# Altium schematic sheet DC-DC_PWM_IV_Controller.SchDoc
size A0; SheetNumber: 1; SheetTotal: 1; SPICEModelCacheFPQAHQWD: <root> / <DocumentId>FPQAHQWD</DocumentId> / <CacheFrame Number="0"> / <Model Name="7850_74477530_1m" Kind="CKT"> / <Text>******* / .subckt 7850_74477530_1m 1 2 / Rp 1 2 187304.915771 / Cp 1 2 4.36976277949p / Rs 1 N3 3.3 / L1 N3 2 1000u / .ends 7850_74477530_1m</Text> / </Model> / </CacheFrame> / </root>
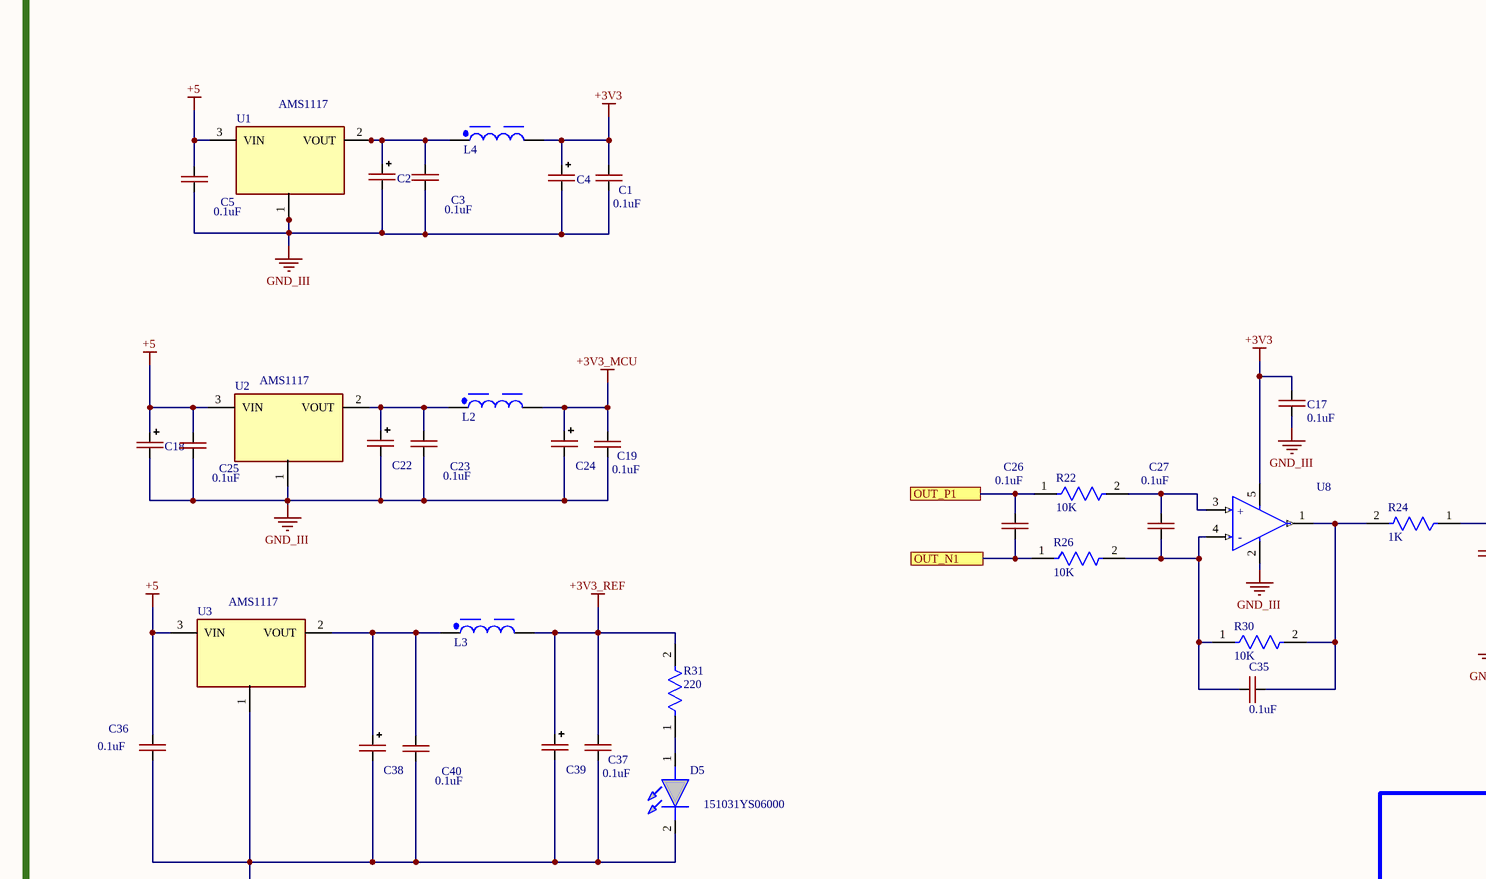
[diagram p0: DC-DC_PWM_IV_Controller.SchDoc, top left]
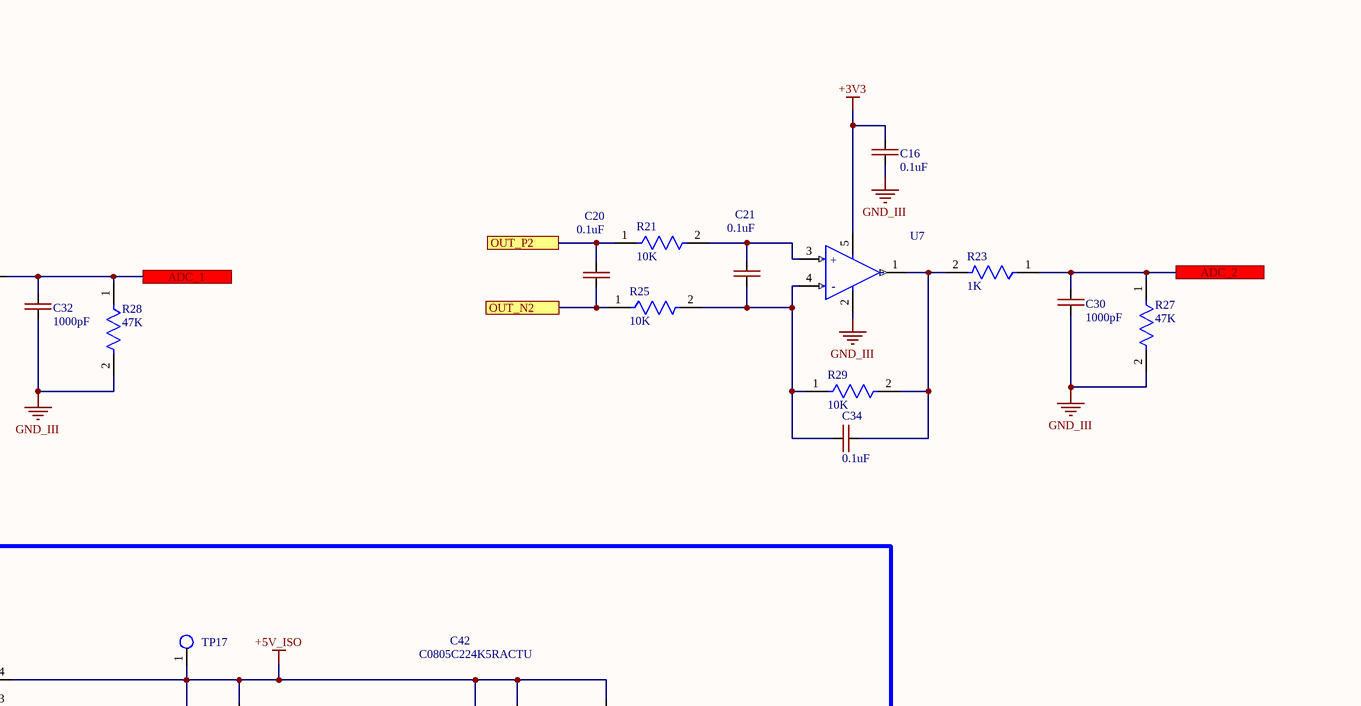
[diagram p1: DC-DC_PWM_IV_Controller.SchDoc, top middle]
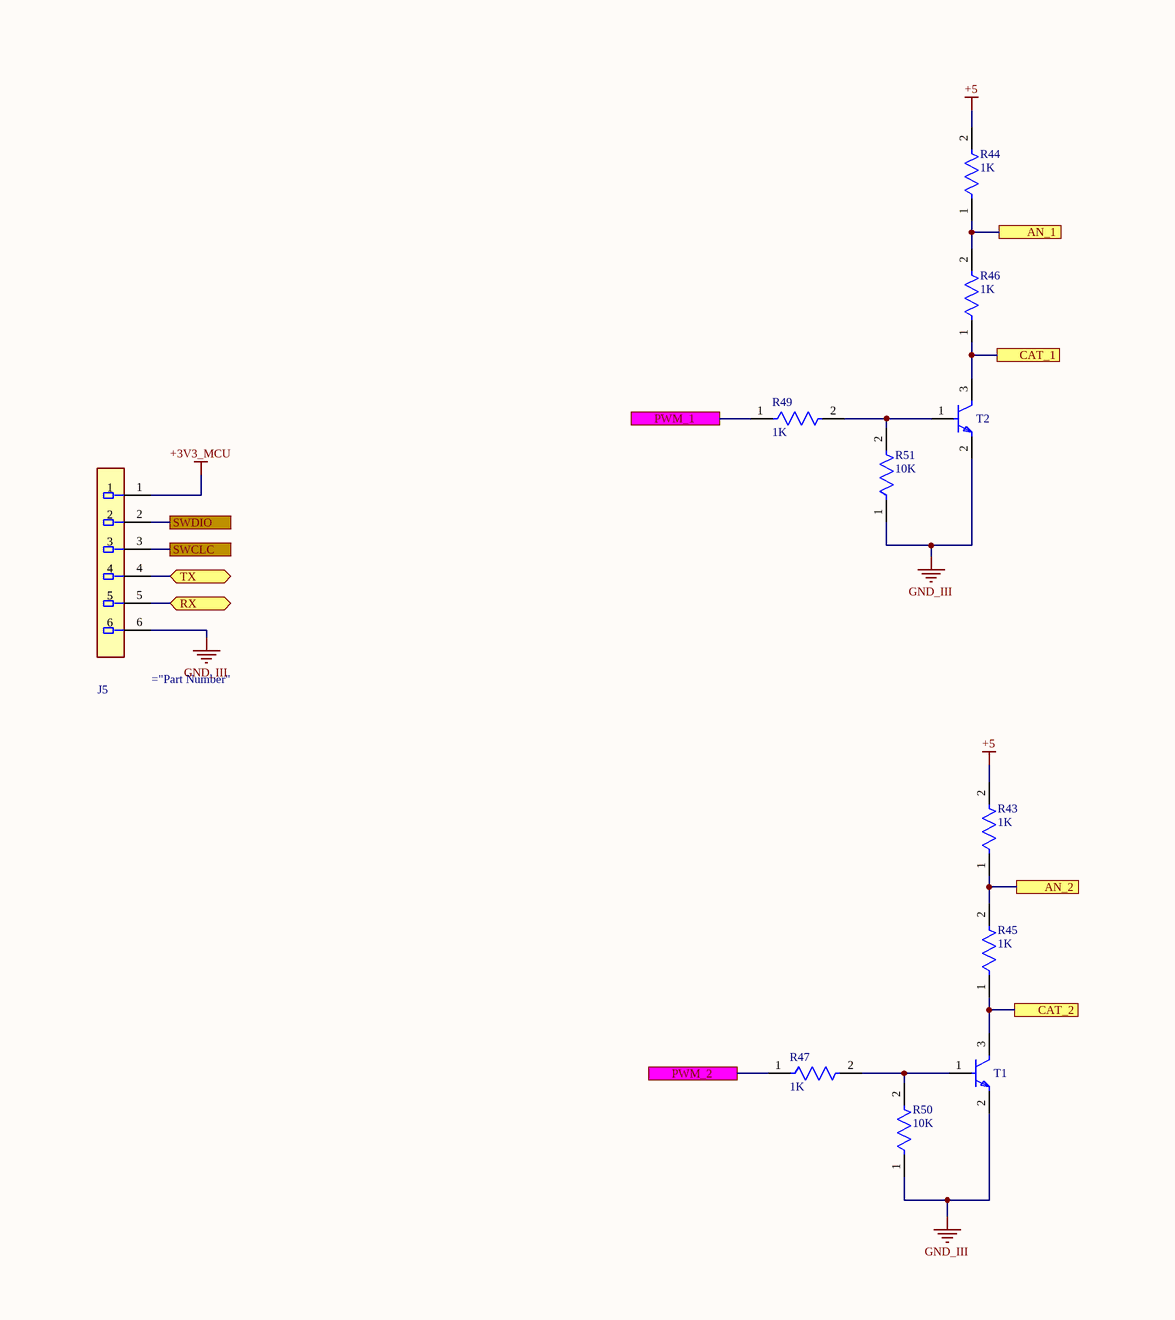
[diagram p2: DC-DC_PWM_IV_Controller.SchDoc, top right]
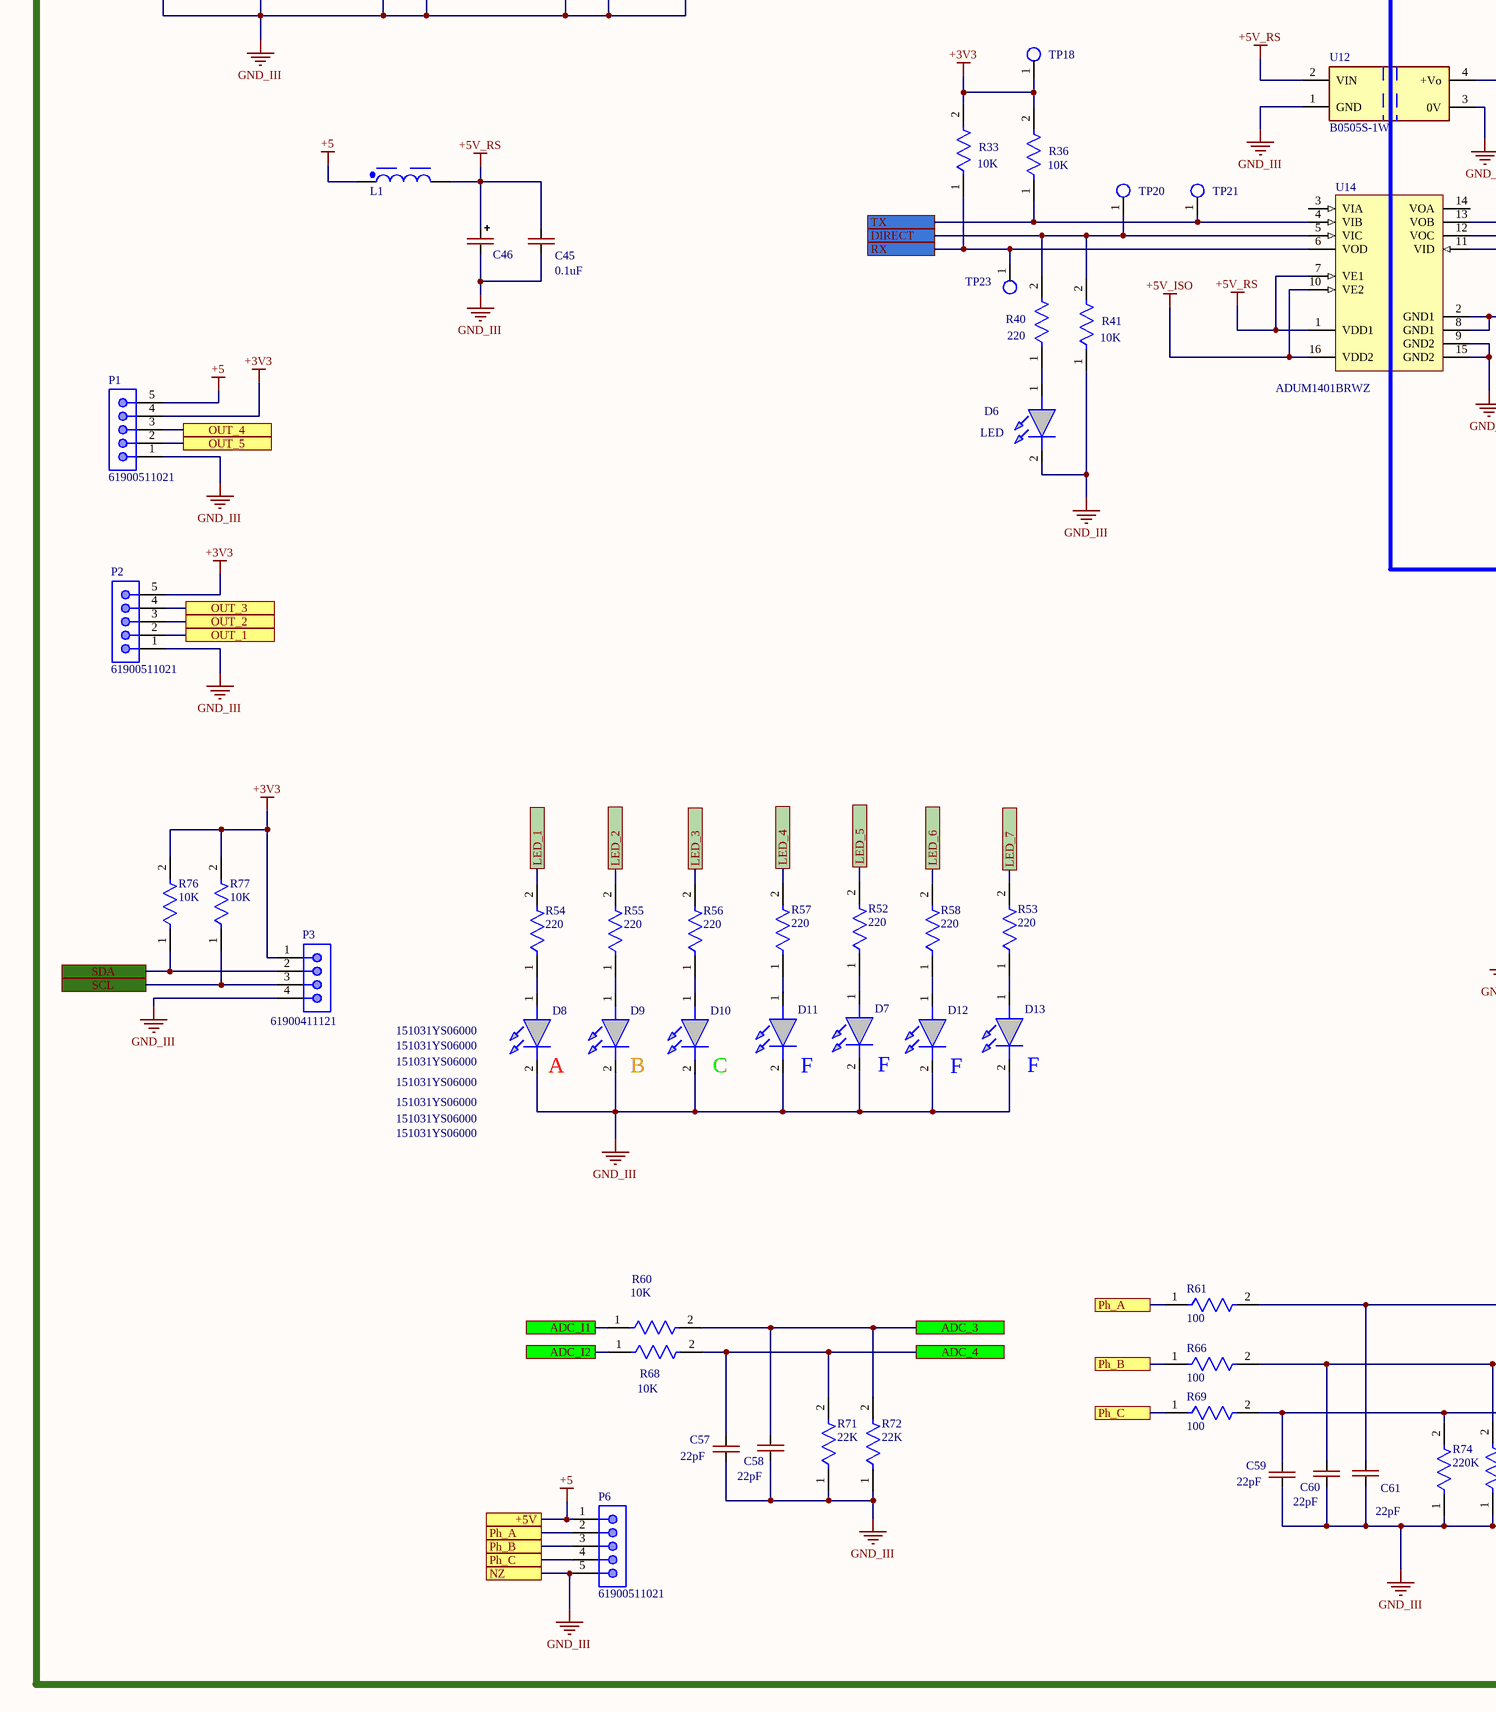
[diagram p3: DC-DC_PWM_IV_Controller.SchDoc, bottom left]
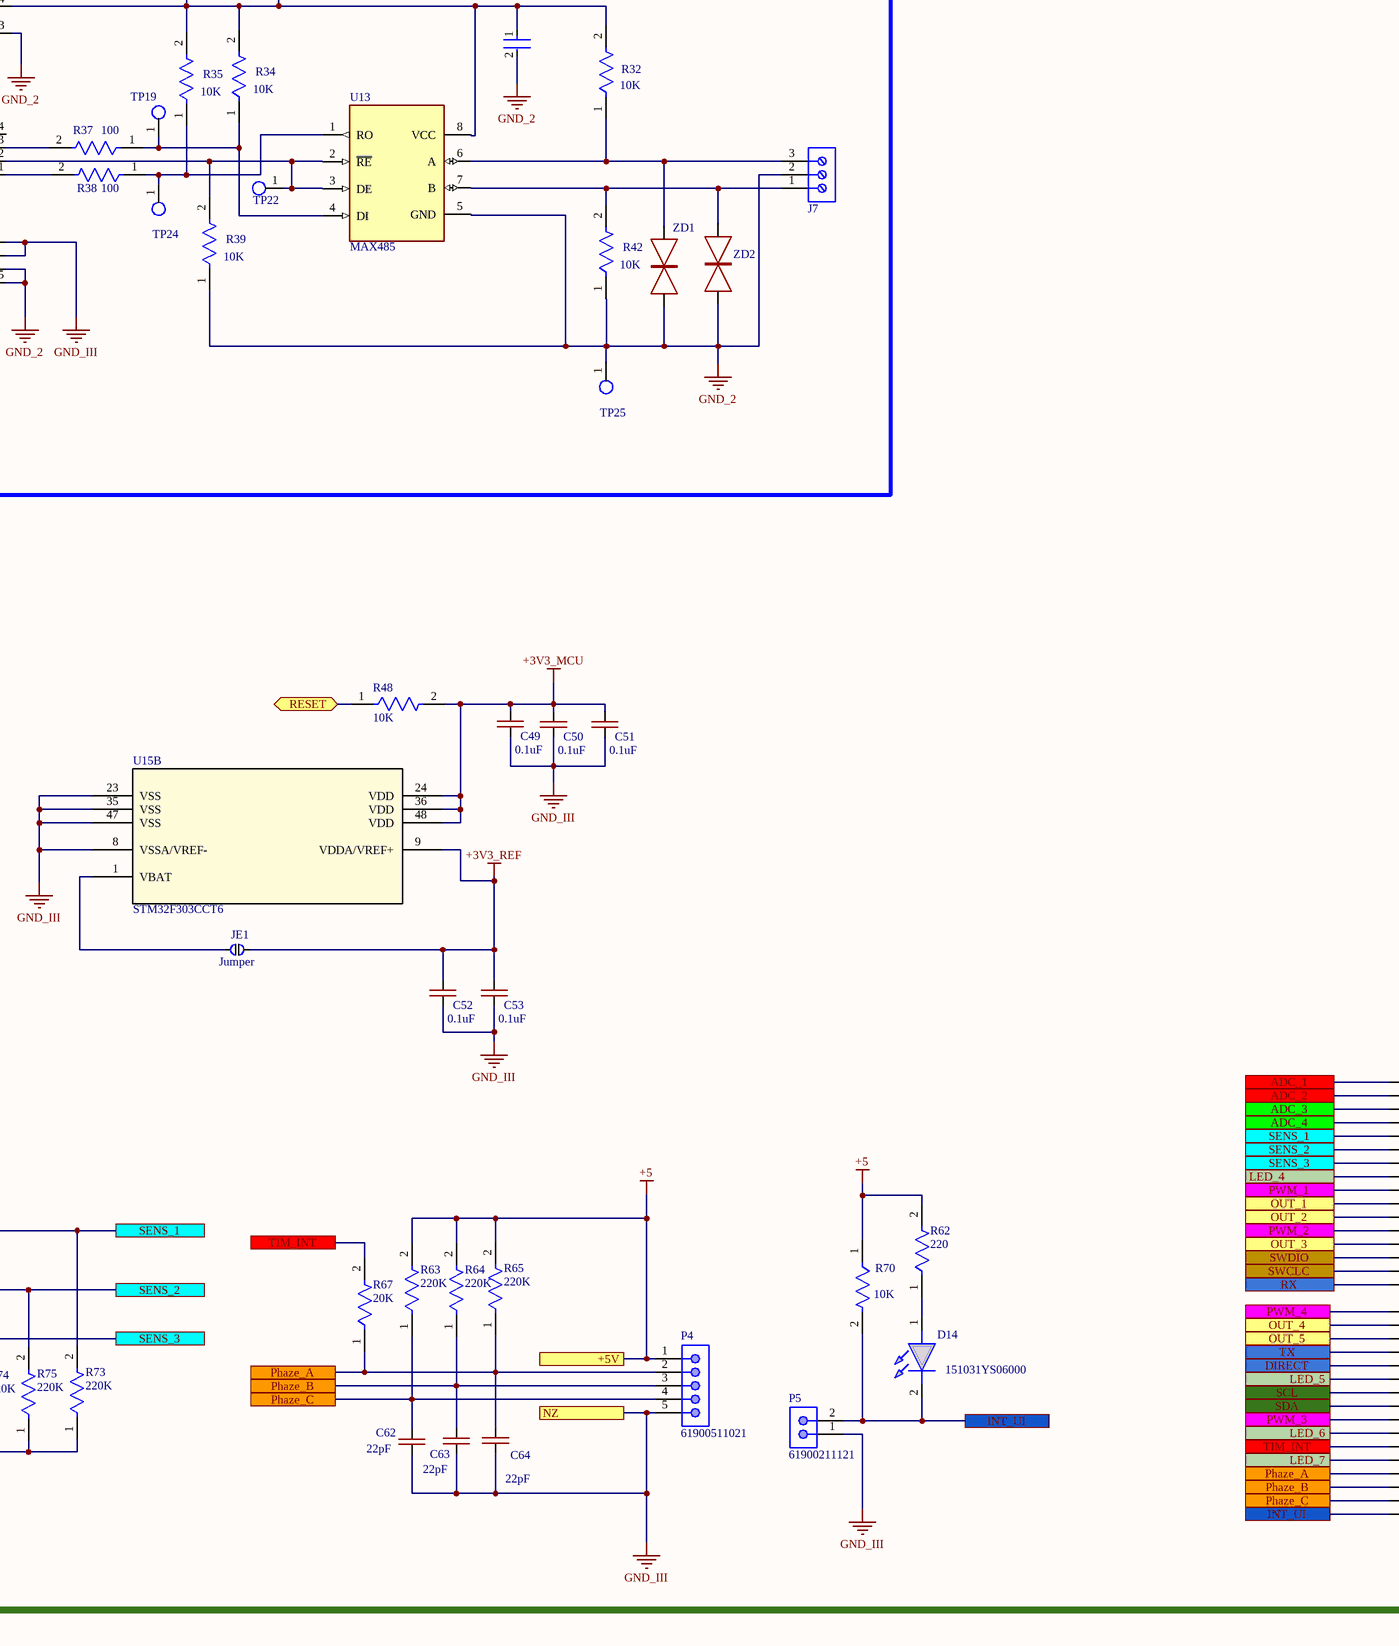
[diagram p4: DC-DC_PWM_IV_Controller.SchDoc, bottom middle]
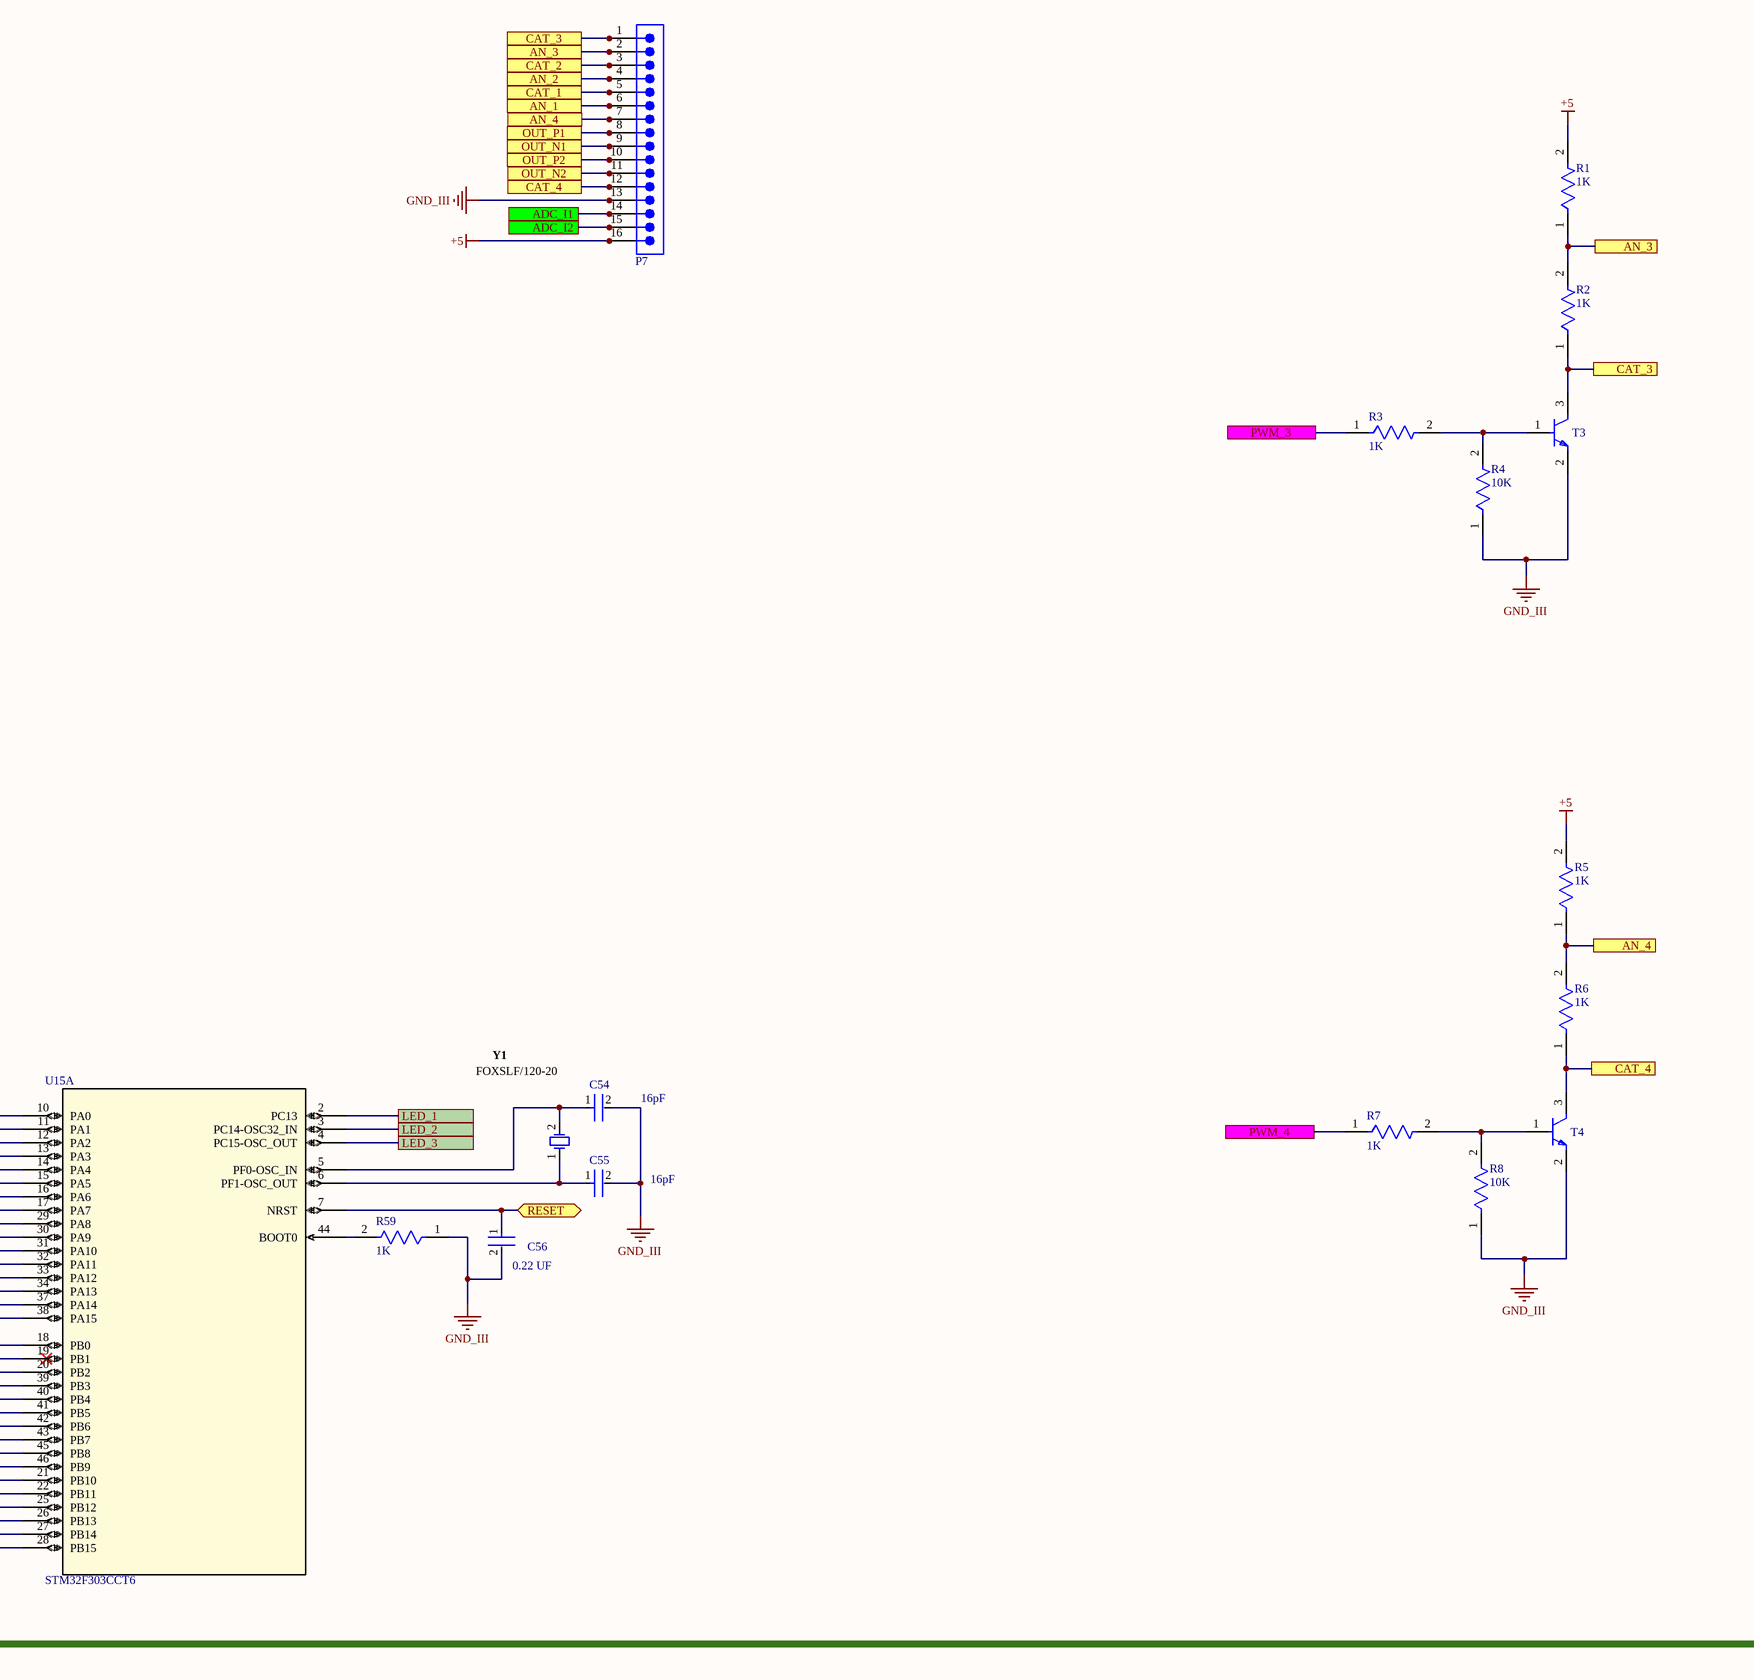
[diagram p5: DC-DC_PWM_IV_Controller.SchDoc, bottom right]

## Parts
C1  0.1uF  [CAP-0805]
C2  CAP-POLAR  [CAP_SMD_Size_E]  (value not drawn)
C3  0.1uF  [CAP-0805]
C4  CAP-POLAR  [CAP_SMD_Size_E]  (value not drawn)
C5  0.1uF  [CAP-0805]
C16  0.1uF  [CAP-0805]
C17  0.1uF  [CAP-0805]
C18  CAP-POLAR  [SIZE_EEE]  (value not drawn)
C19  0.1uF  [CAP-0805]
C20  0.1uF  [CAP-0805]
C21  0.1uF  [CAP-0805]
C22  CAP-POLAR  [SIZE_EEE]  (value not drawn)
C23  0.1uF  [CAP-0805]
C24  CAP-POLAR  [SIZE_EEE]  (value not drawn)
C25  0.1uF  [CAP-0805]
C26  0.1uF  [CAP-0805]
C27  0.1uF  [CAP-0805]
C30  1000pF  [CAP-0805]
C32  1000pF  [CAP-0805]
C34  0.1uF  [CAP-0805]
C35  0.1uF  [CAP-0805]
C36  0.1uF  [CAP-0805]
C37  0.1uF  [CAP-0805]
C38  CAP-POLAR  [SIZE_EEE]  (value not drawn)
C39  CAP-POLAR  [SIZE_EEE]  (value not drawn)
C40  0.1uF  [CAP-0805]
C42  C0805C224K5RACTU  [FP-C0805C-DN-MFG]
C45  0.1uF  [CAP-0805]
C46  CAP-POLAR  [SIZE_EEE]  (value not drawn)
C49  0.1uF  [CAP-0805]
C50  0.1uF  [CAP-0805]
C51  0.1uF  [CAP-0805]
C52  0.1uF  [CAP-0805]
C53  0.1uF  [CAP-0805]
C54  16pF  [FP-GRM21B-0_1-IPC_C]
C55  16pF  [FP-GRM21B-0_1-IPC_C]
C56  0.22 UF  [FP-C0805C-DN-MFG]
C57  22pF  [CAP-0805]
C58  22pF  [CAP-0805]
C59  22pF  [CAP-0805]
C60  22pF  [CAP-0805]
C61  22pF  [CAP-0805]
C62  22pF  [CAP-0805]
C63  22pF  [CAP-0805]
C64  22pF  [CAP-0805]
D5  151031YS06000  [LED_GREEN]
D6  LED  [LED_BLUE]
D7  151031YS06000  [LED_BLUE]
D8  151031YS06000  [LED_RED]
D9  151031YS06000  [LED_YELLOW]
D10  151031YS06000  [LED_GREEN]
D11  151031YS06000  [LED_BLUE]
D12  151031YS06000  [LED_BLUE]
D13  151031YS06000  [LED_BLUE]
D14  151031YS06000  [LED_RED]
J5  SWR25X-NRTC-S06-ST-BA  [Sullins_SWR25X-NRTC-S06-ST-BA_MFG]  (value not drawn)
J7  (no value)  [691101710003]
JE1  Jumper  [JE]
L1  1000µH, 0.3A  [WE-PD2_7850]  (value not drawn)
L2  1000µH, 0.3A  [WE-PD2_7850]  (value not drawn)
L3  1000µH, 0.3A  [WE-PD2_7850]  (value not drawn)
L4  1000µH, 0.3A  [WE-PD2_7850]  (value not drawn)
P1  61900511021  [61900511021]
P2  61900511021  [61900511021]
P3  61900411121  [61900411121]
P4  61900511021  [61900511021]
P5  61900211121  [61900211121]
P6  61900511021  [61900511021]
P7  61301611021  [61301611021]  (value not drawn)
R1  1K  [RES-0805]
R2  1K  [RES-0805]
R3  1K  [RES-0805]
R4  10K  [RES-0805]
R5  1K  [RES-0805]
R6  1K  [RES-0805]
R7  1K  [RES-0805]
R8  10K  [RES-0805]
R21  10K  [RES-0805]
R22  10K  [RES-0805]
R23  1K  [RES-0805]
R24  1K  [RES-0805]
R25  10K  [RES-0805]
R26  10K  [RES-0805]
R27  47K  [RES-0805]
R28  47K  [RES-0805]
R29  10K  [RES-0805]
R30  10K  [RES-0805]
R31  220  [RES-0805]
R32  10K  [RES-0805]
R33  10K  [RES-0805]
R34  10K  [RES-0805]
R35  10K  [RES-0805]
R36  10K  [RES-0805]
R37  100  [RES-0805]
R38  100  [RES-0805]
R39  10K  [RES-0805]
R40  220  [RES-0805]
R41  10K  [RES-0805]
R42  10K  [RES-0805]
R43  1K  [RES-0805]
R44  1K  [RES-0805]
R45  1K  [RES-0805]
R46  1K  [RES-0805]
R47  1K  [RES-0805]
R48  10K  [RES-0805]
R49  1K  [RES-0805]
R50  10K  [RES-0805]
R51  10K  [RES-0805]
R52  220  [RES-0805]
R53  220  [RES-0805]
R54  220  [RES-0805]
R55  220  [RES-0805]
R56  220  [RES-0805]
R57  220  [RES-0805]
R58  220  [RES-0805]
R59  1K  [RES-0805]
R60  10K  [RES-0805]
R61  100  [RES-0805]
R62  220  [RES-0805]
R63  220K  [RES-0805]
R64  220K  [RES-0805]
R65  220K  [RES-0805]
R66  100  [RES-0805]
R67  20K  [RES-0805]
R68  10K  [RES-0805]
R69  100  [RES-0805]
R70  10K  [RES-0805]
R71  22K  [RES-0805]
R72  22K  [RES-0805]
R73  220K  [RES-0805]
R74  220K  [RES-0805]
R75  220K  [RES-0805]
R76  10K  [RES-0805]
R77  10K  [RES-0805]
T1  BC847C  [SOT23-3_IPC_A]  (value not drawn)
T2  BC847C  [SOT23-3_IPC_A]  (value not drawn)
T3  BC847C  [SOT23-3_IPC_A]  (value not drawn)
T4  BC847C  [SOT23-3_IPC_A]  (value not drawn)
TP17  Test_Point_PCB  [Test_Point]  (value not drawn)
TP18  (no value)  [Test_Point]
TP19  Test_Point_PCB  [Test_Point]  (value not drawn)
TP20  Test_Point_PCB  [Test_Point]  (value not drawn)
TP21  Test_Point_PCB  [Test_Point]  (value not drawn)
TP22  Test_Point_PCB  [Test_Point]  (value not drawn)
TP23  Test_Point_PCB  [Test_Point]  (value not drawn)
TP24  (no value)  [Test_Point]
TP25  Test_Point_PCB  [Test_Point]  (value not drawn)
U1  AMS1117  [SOT-89]
U2  AMS1117  [SOT-89]
U3  AMS1117  [SOT-89]
U7  (no value)  [SOT-23-5]
U8  (no value)  [SOT-23-5]
U12  B0505S-1W  [B0505S-1W]
U13  MAX485  [SOIC-8-MFG]
U14  ADUM1401BRWZ  [ADI-RW-16_M]
U15  STM32F303CCT6  [LQFP48-7x7mm]  (parts A,B of 2)
Y1  FOXSLF/120-20  [FOX-FOXSLF-2_V]
ZD1  P6SMB16CA  [DO-214AA]  (value not drawn)
ZD2  P6SMB16CA  [DO-214AA]  (value not drawn)

## Ports
+5V, ADC_1, ADC_2, ADC_3, ADC_4, ADC_I1, ADC_I2, AN_1, AN_2, AN_3, AN_4, CAT_1, CAT_2, CAT_3, CAT_4, DIRECT, INT_UI, LED_1, LED_2, LED_3, LED_4, LED_5, LED_6, LED_7, NZ, OUT_1, OUT_2, OUT_3, OUT_4, OUT_5, OUT_N1, OUT_N2, OUT_P1, OUT_P2, Ph_A, Ph_B, Ph_C, Phaze_A, Phaze_B, Phaze_C, PWM_1, PWM_2, PWM_3, PWM_4, RESET (bidir), RX, RX (bidir), SCL, SDA, SENS_1, SENS_2, SENS_3, SWCLC, SWDIO, TIM_INT, TX, TX (bidir)

## Nets
+3V3: C1.2 C4.1(+) C16.2 C17.2 L4.2 P1.4 P2.5 P3.1 R33.2 R36.2 R76.2 R77.2 TP18.1(G9) U7.5(VDD) U8.5(VDD)
+3V3_MCU: C19.2 C24.1(+) C49.2 C50.2 C51.2 J5.1 L2.2 R48.2 U15.24(VDD) U15.36(VDD) U15.48(VDD)
+3V3_REF: C37.2 C39.1(+) C52.2 C53.2 JE1.1 L3.2 R31.2 U15.9(VDDA/VREF+)
+5: C5.2 C18.1(+) C25.2 C36.2 L1.1 P1.5 P4.1 P6.1 P7.16 R1.2 R5.2 R43.2 R44.2 R62.2 R63.2 R64.2 R65.2 R70.1 U1.3(VIN) U2.3(VIN) U3.3(VIN) ; port +5V
+5V_ISO: C42.1 R32.2 R34.2 R35.2 TP17.1(G9) U12.4(+Vo) U13.8(VCC) U14.10(VE2) U14.16(VDD2)
+5V_RS: C45.2 C46.1(+) L1.2 U12.2(VIN) U14.1(VDD1) U14.7(VE1)
GND_2: C42.2 J7.2 R39.1 R42.1 TP25.1(G9) U12.3(0V) U13.5(GND) U14.9(GND2) U14.15(GND2) ZD1.1(A) ZD2.1(A)
GND_III: C1.1 C2.2(-) C3.1 C4.2(-) C5.1 C16.1 C17.1 C18.2(-) C19.1 C22.2(-) C23.1 C24.2(-) C25.1 C30.1 C32.1 C36.1 C37.1 C38.2(-) C39.2(-) C40.1 C45.1 C46.2(-) C49.1 C50.1 C51.1 C52.1 C53.1 C54.2 C55.2 C56.2 C57.1 C58.1 C59.1 C60.1 C61.1 C62.1 C63.1 C64.1 D5.2(K) D6.2(K) D7.2(K) D8.2(K) D9.2(K) D10.2(K) D11.2(K) D12.2(K) D13.2(K) J5.6 P1.1 P2.1 P3.4 P4.5 P5.1 P6.5 P7.13 R4.1 R8.1 R27.2 R28.2 R41.1 R50.1 R51.1 R59.1 R71.1 R72.1 R73.1 R74.1 R75.1 T1.2(E) T2.2(E) T3.2(E) T4.2(E) U1.1(Ground) U2.1(Ground) U3.1(Ground) U7.2(VSS) U8.2(VSS) U12.1(GND) U14.2(GND1) U14.8(GND1) U15.8(VSSA/VREF-) U15.23(VSS) U15.35(VSS) U15.47(VSS) ; port NZ
ADC_1: C32.2 R24.1 R28.1 U15.10(PA0) ; port ADC_1
ADC_2: C30.2 R23.1 R27.1 U15.11(PA1) ; port ADC_2
ADC_3: C58.2 R60.2 R72.2 U15.12(PA2) ; port ADC_3
ADC_4: C57.2 R68.2 R71.2 U15.13(PA3) ; port ADC_4
ADC_I1: P7.14 R60.1 ; port ADC_I1
ADC_I2: P7.15 R68.1 ; port ADC_I2
AN_1: P7.6 R44.1 R46.2 ; port AN_1
AN_2: P7.4 R43.1 R45.2 ; port AN_2
AN_3: P7.2 R1.1 R2.2 ; port AN_3
AN_4: P7.7 R5.1 R6.2 ; port AN_4
CAT_1: P7.5 R46.1 T2.3(C) ; port CAT_1
CAT_2: P7.3 R45.1 T1.3(C) ; port CAT_2
CAT_3: P7.1 R2.1 T3.3(C) ; port CAT_3
CAT_4: P7.12 R6.1 T4.3(C) ; port CAT_4
DIRECT: R40.2 R41.2 TP20.1(G9) U14.5(VIC) U15.40(PB4) ; port DIRECT
INT_UI: D14.2(K) P5.2 R70.2 U15.28(PB15) ; port INT_UI
LED_1: R54.2 U15.2(PC13) ; port LED_1
LED_2: R55.2 U15.3(PC14-OSC32_IN) ; port LED_2
LED_3: R56.2 U15.4(PC15-OSC_OUT) ; port LED_3
LED_4: R57.2 U15.17(PA7) ; port LED_4
LED_5: R52.2 U15.41(PB5) ; port LED_5
LED_6: R58.2 U15.46(PB9) ; port LED_6
LED_7: R53.2 U15.22(PB11) ; port LED_7
OUT_1: P2.2 U15.30(PA9) ; port OUT_1
OUT_2: P2.3 U15.31(PA10) ; port OUT_2
OUT_3: P2.4 U15.33(PA12) ; port OUT_3
OUT_4: P1.3 U15.19(PB1) ; port OUT_4
OUT_5: P1.2 U15.20(PB2) ; port OUT_5
OUT_N1: C26.1 P7.9 R26.1 ; port OUT_N1
OUT_N2: C20.1 P7.11 R25.1 ; port OUT_N2
OUT_P1: C26.2 P7.8 R22.1 ; port OUT_P1
OUT_P2: C20.2 P7.10 R21.1 ; port OUT_P2
Ph_A: P6.2 R61.1 ; port Ph_A
Ph_B: P6.3 R66.1 ; port Ph_B
Ph_C: P6.4 R69.1 ; port Ph_C
Phaze_A: C64.2 P4.2 R65.1 R67.1 U15.25(PB12) ; port Phaze_A
Phaze_B: C63.2 P4.3 R64.1 U15.26(PB13) ; port Phaze_B
Phaze_C: C62.2 P4.4 R63.1 U15.27(PB14) ; port Phaze_C
PWM_1: R49.1 U15.29(PA8) ; port PWM_1
PWM_2: R47.1 U15.32(PA11) ; port PWM_2
PWM_3: R3.1 U15.45(PB8) ; port PWM_3
PWM_4: R7.1 U15.18(PB0) ; port PWM_4
RESET: C56.1 R48.1 U15.7(NRST) ; port RESET
RX: J5.5 R33.1 TP23.1(G9) U14.6(VOD) U15.38(PA15) ; port RX
SCL: P3.3 R77.1 U15.42(PB6) ; port SCL
SDA: P3.2 R76.1 U15.43(PB7) ; port SDA
SENS_1: C61.2 R61.2 R73.2 U15.14(PA4) ; port SENS_1
SENS_2: C60.2 R66.2 R75.2 U15.15(PA5) ; port SENS_2
SENS_3: C59.2 R69.2 R74.2 U15.16(PA6) ; port SENS_3
SWCLC: J5.3 U15.37(PA14) ; port SWCLC
SWDIO: J5.2 U15.34(PA13) ; port SWDIO
TIM_INT: R67.2 U15.21(PB10) ; port TIM_INT
TX: J5.4 R36.1 TP21.1(G9) U14.4(VIB) U15.39(PB3) ; port TX
NetC2_1: C2.1(+) C3.2 L4.1 U1.2(VOUT)
NetC21_1: C21.1 C34.1 R25.2 R29.1 U7.4(VIN-)
NetC21_2: C21.2 R21.2 U7.3(VIN+)
NetC22_1: C22.1(+) C23.2 L2.1 U2.2(VOUT)
NetC27_1: C27.1 C35.1 R26.2 R30.1 U8.4(VIN-)
NetC27_2: C27.2 R22.2 U8.3(VIN+)
NetC34_2: C34.2 R23.2 R29.2 U7.1(VOUT)
NetC35_2: C35.2 R24.2 R30.2 U8.1(VOUT)
NetC38_1: C38.1(+) C40.2 L3.1 U3.2(VOUT)
NetC54_1: C54.1 U15.5(PF0-OSC_IN) Y1.2
NetC55_1: C55.1 U15.6(PF1-OSC_OUT) Y1.1
NetD5_1: D5.1(A) R31.1
NetD6_1: D6.1(A) R40.1
NetD7_1: D7.1(A) R52.1
NetD8_1: D8.1(A) R54.1
NetD9_1: D9.1(A) R55.1
NetD10_1: D10.1(A) R56.1
NetD11_1: D11.1(A) R57.1
NetD12_1: D12.1(A) R58.1
NetD13_1: D13.1(A) R53.1
NetD14_1: D14.1(A) R62.1
NetJ7_1: J7.1 R42.2 U13.7(B) ZD2.2(A)
NetJ7_3: J7.3 R32.1 U13.6(A) ZD1.2(A)
NetJE1_2: JE1.2 U15.1(VBAT)
NetR3_2: R3.2 R4.2 T3.1(B)
NetR7_2: R7.2 R8.2 T4.1(B)
NetR34_1: R34.1 R37.1 TP19.1(G9) U13.4(DI)
NetR35_1: R35.1 R38.1 TP24.1(G9) U13.1(RO)
NetR37_2: R37.2 U14.13(VOB)
NetR38_2: R38.2 U14.11(VID)
NetR39_2: R39.2 TP22.1(G9) U13.2(~{RE}) U13.3(DE) U14.12(VOC)
NetR47_2: R47.2 R50.2 T1.1(B)
NetR49_2: R49.2 R51.2 T2.1(B)
NetR59_2: R59.2 U15.44(BOOT0)

Not connected (* = marked no-connect by the designer): U14 3(VIA) 14(VOA)

## Notes on the sheet
- (near D8) A
- (near D9) B
- (near D10) C
- (near D11) F
- (near D7) F
- (near D12) F
- (near D13) F
- (in symbol MCP6001T) +; -

## Library data of the parts
C1 C3 C5 C16 C17 C19-C21 C23 C25-C27 C30 C32 C34-C37 C40 C45 C49-C53 C57-C64 = CAP-NON-POLAR
C42 = CMP-1036-04552-2: CAP CER 0.22UF 50V X7R 0805; Manufacturer: KEMET; Value: 0.22 μF; Temperature Coefficient: 30ppm/°C; Material: Ceramic; Tolerance: 0.1; ComponentLink2URL: https://content.kemet.com/datasheets/KEM_C1003_C0G_SMD.pdf; Temperature Characteristic: X7R; Device Class L3: Ceramic Capacitors; Lead Free: Yes; Temperature: -55°C to +125°C; RoHS: TRUE; Capacitance: 0.22 μF; Automotive: No; Octopart: https://octopart.com/c0805c224k5ractu-kemet-144670; Manufacturer Part Number: C0805C224K5RACTU; Temperature Range Low: -55°C; Height: 0.88mm; Device Class L1: Passive Components; Digikey Description: CAP CER 0.22UF 50V X7R 0805; ComponentLink2Description: Datasheet; Mouser Description: CAP CER 0.22UF 50V X7R 0805; Category: Cap; Ipc Land Pattern Name: CAPC200125X78; Temperature Range High: +125°C; Package: C0805C-DN; Device Class L2: Capacitors; Voltage Rating: 50 V
C54 C55 = CMP-2007-03453-2: Chip Multilayer Ceramic Capacitors for General Purpose, 0805, 16pF, X5R, 15%, 10%, 16V; Capacitance: 10uF; Radiation Hardening: No; Thickness: 0.053inch; Voltage Rating (DC): 16V; Lead Free: Lead Free; Package Quantity: 1; Width: 1.25mm; Case Code (Imperial): 0805; Depth: 1.25mm; Packaging: Tape and Reel; Dielectric: X5R; Max Operating Temperature: 85°C; Tolerance: 10%; Voltage Rating: 16V; Voltage: 16V; Height: 1.25mm; Case Code (Metric): 2012; Material: Ceramic; Mount: Surface Mount; Case/Package: 0805; REACH SVHC: No SVHC; Length: 2mm; Min Operating Temperature: -55°C; Termination: SMD/SMT
C56 = CMP-1036-04552-2: CAP CER 0.22UF 50V X7R 0805; Manufacturer: KEMET; Manufacturer Part Number: C0805C224K5RACTU; Value: 0.22 μF; Temperature Coefficient: 30ppm/°C; Material: Ceramic; Tolerance: 0.1; ComponentLink2URL: https://content.kemet.com/datasheets/KEM_C1003_C0G_SMD.pdf; Temperature Characteristic: X7R; Device Class L3: Ceramic Capacitors; Lead Free: Yes; Temperature: -55°C to +125°C; RoHS: TRUE; Capacitance: 0.22 μF; Automotive: No; Octopart: https://octopart.com/c0805c224k5ractu-kemet-144670; Temperature Range Low: -55°C; Height: 0.88mm; Device Class L1: Passive Components; Digikey Description: CAP CER 0.22UF 50V X7R 0805; ComponentLink2Description: Datasheet; Mouser Description: CAP CER 0.22UF 50V X7R 0805; Category: Cap; Ipc Land Pattern Name: CAPC200125X78; Temperature Range High: +125°C; Package: C0805C-DN; Device Class L2: Capacitors; Voltage Rating: 50 V
D5-D14 = LED: WURTH ELEKTRONIK - 151031YS06000 - LED, Yellow, Through Hole, T-1 (3mm), 30 mA, 2 V, 590 nm; Geometry.Height: 5.5mm; Manufacturer_Name: Wurth Elektronik; Manufacturer_Part_Number: 151031YS06000; Mouser Part Number: 710-151031YS06000; Mouser Price/Stock: https://www.mouser.co.uk/ProductDetail/Wurth-Elektronik/151031YS06000?qs=LlUlMxKIyB3xSYYW%252BcuBiQ%3D%3D; Arrow Part Number: *; Arrow Price/Stock: *; Mouser Testing Part Number: *; Mouser Testing Price/Stock: *; Datasheet Link: https://katalog.we-online.de/led/datasheet/151031YS06000.pdf
J7 = 691101710003: WR-TBL Series 101 Horizontal Entry Modular, Through Hole, pitch 5mm, 3p; Manufacturer: Wurth Elektronik; Pin Number: 3; Rated Current: 16A; Working Voltage: 250V; PCB/Cable/Panel: PCB; Modularity: Yes; ComponentLink1Description: Manufacturer Link; ComponentLink1URL: https://www.we-online.com/redexpert/article/691101710003?ad; ComponentLink2Description: Datasheet; ComponentLink2URL: https://www.we-online.com/redexpert/spec/691101710003?ad; Category: Terminal Blocks; Match Code: WR-TBL; Manufacturer Part Number: 691101710003; Mount: Through Hole; Operating Temperature Max: 105°C; Operating Temperature Min: -40°C; Packaging: Box; Pitch: 5mm; Orientation: Horizontal; Application: Pressure Clamp
JE1 = JE
L1-L4 = 74477530: WE-PD2 SMT Power Inductor, size 7850, 1000µH, 0.3A, 3.3Ω; Manufacturer: Wurth Elektronik; Case/Size Code: 7850; DC Resistance: 2.78Ω; Self Resonant Frequency: 2.4MHz; Manufacturer Part Number: 74477530; Category: Unshielded Power Inductors; Match Code: WE-PD2; ComponentLink1Description: Website Link; ComponentLink1URL: https://www.we-online.com/redexpert/article/74477530?ad; ComponentLink2Description: Datasheet Link; ComponentLink2URL: https://www.we-online.com/redexpert/spec/74477530?ad; Mount: Surface Mount; Operating Temperature Max: 125°C; Operating Temperature Min: -40°C; Packaging: Tape and Reel; Length: 7.8mm; Width: 7mm; Height: 4.95mm; DC Resistance Max: 3.3Ω; Inductance: 1000µH; Rated Current: 0.3A; Saturation Current: 0.3A
P1 P2 P4 P6 = 61900511021: WR-WTB THT Male Left Angled Bottom Locking Header, pitch 2.54mm, 5p; Pin Number: 5; Contact Resistance: 20mOhm; Rated Current: 3A; Withstanding Voltage: 1000VAC; Working Voltage: 250VAC; ComponentLink1Description: Manufacturer; ComponentLink1URL: http://www.we-online.de; ComponentLink2Description: Datasheet; ComponentLink2URL: https://www.we-online.com/catalog/datasheet/61900511021.pdf; Pitch: 2.54mm; Published Date: January 2020; Publisher: Wurth Elektronik; Mounting Technology: THT; Packaging: Bag; Operating Temperature: -40 to +105degC; Part Number: 61900511021; Gender: Male; Type: Right Angled Bottom Locking
P3 = 61900411121: WR-WTB THT Male Vertical Locking Header, pitch 2.54mm, 4p; Pin Number: 4; Contact Resistance: 20mOhm; Rated Current: 3A; Withstanding Voltage: 1000VAC; Working Voltage: 250VAC; ComponentLink1Description: Manufacturer; ComponentLink1URL: http://www.we-online.de; ComponentLink2Description: Datasheet; ComponentLink2URL: https://www.we-online.com/catalog/datasheet/61900411121.pdf; Pitch: 2.54mm; Published Date: January 2020; Publisher: Wurth Elektronik; Mounting Technology: THT; Packaging: Bag; Operating Temperature: -40 to +105degC; Part Number: 61900411121; Gender: Male; Type: Vertical
P5 = 61900211121: WR-WTB THT Male Vertical Locking Header, pitch 2.54mm, 2p; Pin Number: 2; Contact Resistance: 20mOhm; Rated Current: 3A; Withstanding Voltage: 1000VAC; Working Voltage: 250VAC; ComponentLink1Description: Manufacturer; ComponentLink1URL: http://www.we-online.de; ComponentLink2Description: Datasheet; ComponentLink2URL: https://www.we-online.com/catalog/datasheet/61900211121.pdf; Pitch: 2.54mm; Published Date: January 2020; Publisher: Wurth Elektronik; Mounting Technology: THT; Packaging: Bag; Operating Temperature: -40 to +105degC; Part Number: 61900211121; Gender: Male; Type: Vertical
P7 = 61301611021: WR-PHD Pin Header, THT, Angled, pitch 2.54mm, 1 Row, 16P; Manufacturer: Wurth Elektronik; Contact Resistance: 20mΩ; Rated Current: 3A; Working Voltage: 250V; Withstanding Voltage: 500V; ComponentLink1Description: Website Link; ComponentLink1URL: https://www.we-online.com/redexpert/article/61301611021?ad; ComponentLink2Description: Datasheet Link; ComponentLink2URL: https://www.we-online.com/redexpert/spec/61301611021?ad; Manufacturer Part Number: 61301611021; Category: Board-to-Board Connectors; Match Code: WR-PHD; Mount: Through Hole; Operating Temperature Max: 105°C; Operating Temperature Min: -40°C; Packaging: Bag; Gender: Pin Header; Number of Pins: 16; Number of Rows: 1; Orientation: Angled; Pitch: 2.54mm
R1-R8 R21-R77 = RES-CONST
TP17-TP25 = TP_PCB?: Test_Point
U7 U8 = MCP6001T: IC OPAMP GP 1 CIRCUIT SOT23-5; Number of Amplifiers: 1; Voltage: 6V; Power Supply Rejection Ratio (PSRR): 86dB; Common Mode Rejection Ratio: 60dB; Unity Gain Bandwidth Product: 1MHz; Slew Rate: 0.6V/µs; Output Current per Channel: 23mA; Nominal Supply Current: 100uA; Input Offset Voltage (Vos): 4.5mV; Input Bias Current: 1pA; Operating Supply Voltage: 5.5V; Min Supply Voltage: 1.8V; Voltage Gain: 112dB; Length: 3.1mm; REACH SVHC: No SVHC; Number of Pins: 5; Package Quantity: 1; Radiation Hardening: No; Mount: Surface Mount; Number of Circuits: 1; Number of Elements: 1; Output Current: 23mA; Packaging: Tape and Reel; Height: 1.3mm; Lead Free: Lead Free; Min Operating Temperature: -40°C; Bandwidth: 1MHz; Contact Plating: Tin; Max Supply Voltage: 6V; Max Operating Temperature: 85°C; Width: 1.8mm; Case/Package: SOT-23; Operating Supply Current: 100uA; Number of Channels: 1; Gain Bandwidth Product: 1MHz
U14 = CMP-0534-00565-1: Quad Channel Digital Isolator, 2.5 KV rms Insulation Rating, 10 Mbps Data Rate, 50 ns Delay, Industrial, 16-pin SOIC (RW-16), Tube; Manufacturer: Analog Devices; Max Data Rate: 10Mbps; ComponentLink2URL: http://www.analog.com/static/imported-files/data_sheets/ADuM1400_1401_1402.pdf; ComponentLink5Description: URL Link2; ComponentLink3URL: http://www.analog.com/static/imported-files/packages/PKG_PDF/SOIC_WIDE%20%28RW%29/RW_16.pdf; DatasheetVersion: Rev. H; ComponentLink2Description: Datasheet; ComponentLink3Description: Package Specification; PartNumber: ADUM1401BRWZ; ComponentLink5URL: Reference Circuit:http://www.analog.com/en/interface-isolation/digital-isolators/adum1401/products/product.html#product-recommendations; Max Operating Temp (degreesC): 125; PackageReference: RW-16; PackageVersion: 032707-B, 03/2007; ComponentLink1Description: Manufacturer URL; Code_JEDEC: MS-013-AA; PackageDescription: 16-Pin Standard Small Outline Package, Body 10.3 x 7.5 mm, Pitch 1.27 mm; Mounting Technology: Surface Mount; ComponentLink1URL: http://www.analog.com/en/index.html; ComponentLink4Description: URL Link1; ComponentLink4URL: Product URL:http://www.analog.com/en/interface-isolation/digital-isolators/adum1401/products/product.html
U15 = STM32F303CCT6: No Description Available; Mfr_Name: STMicroelectronics; RefDes: RefDes; Type: Type
Y1 = CMP-1749-00004-1: Resistance Weld Thru-Hole Crystal, 12 MHz, +/-30 ppm, -20 to 70 degC, 2-Pin THD, RoHS, Bulk; Elements: 1; Rds On Max: 115 mohm; Typical Rise Time: 90 ns; Max Power Dissipation: 2.5 W; Case\Package: TO-251-3; Input Capacitance: 350 pF; REACH SVHC: No SVHC; Length: 6.6 mm; ComponentLink1URL: http://www.foxonline.com/; PackageDescription: 2-Pin Through Hole Device, Body 11.35 x 4.65 mm, Pitch 4.88 mm; Radiation Hardening: No; Package Quantity: 70; Packaging: Rail/Tube; ComponentLink1Description: Manufacturer URL; Min Operating Temperature: -55 degC; Max Operating Temperature: 150 degC; RoHSCompliant: true; PackageReference: FOXSLF-2; DatasheetVersion: Mar-15; Pins: 3; Height: 6.1 mm; Mount: Through Hole; ComponentLink2URL: http://www.foxonline.com/pdfs/hc49slf.pdf; ComponentLink2Description: Datasheet; Width: 2.3 mm